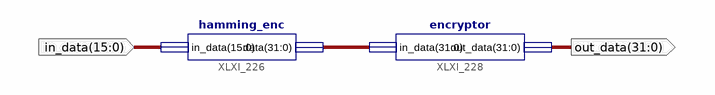
[diagram p0: schematic sheet 1]
// Xilinx ISE schematic stn.sch (spartan6) as structural Verilog: 2 symbols, 2 ports
module stn (
  input  [15:0] in_data,
  output [31:0] out_data
);

  wire [31:0] XLXN_301;

  hamming_enc XLXI_226 (.in_data(in_data), .data(XLXN_301));
  encryptor XLXI_228 (.in_data(XLXN_301), .out_data(out_data));
endmodule
